# EasyEDA Pro project ESD_System.eprj, schematic Schematic4
Board Name: Ohmeter_Board; Create Date: 2026-07-01; Page Name: P1; Project Name: ESD_System; Schematic Name: Schematic4; Update Date: 2026-07-01; Company: EasyEDA.com; Page Size: A4; Version: V1.0
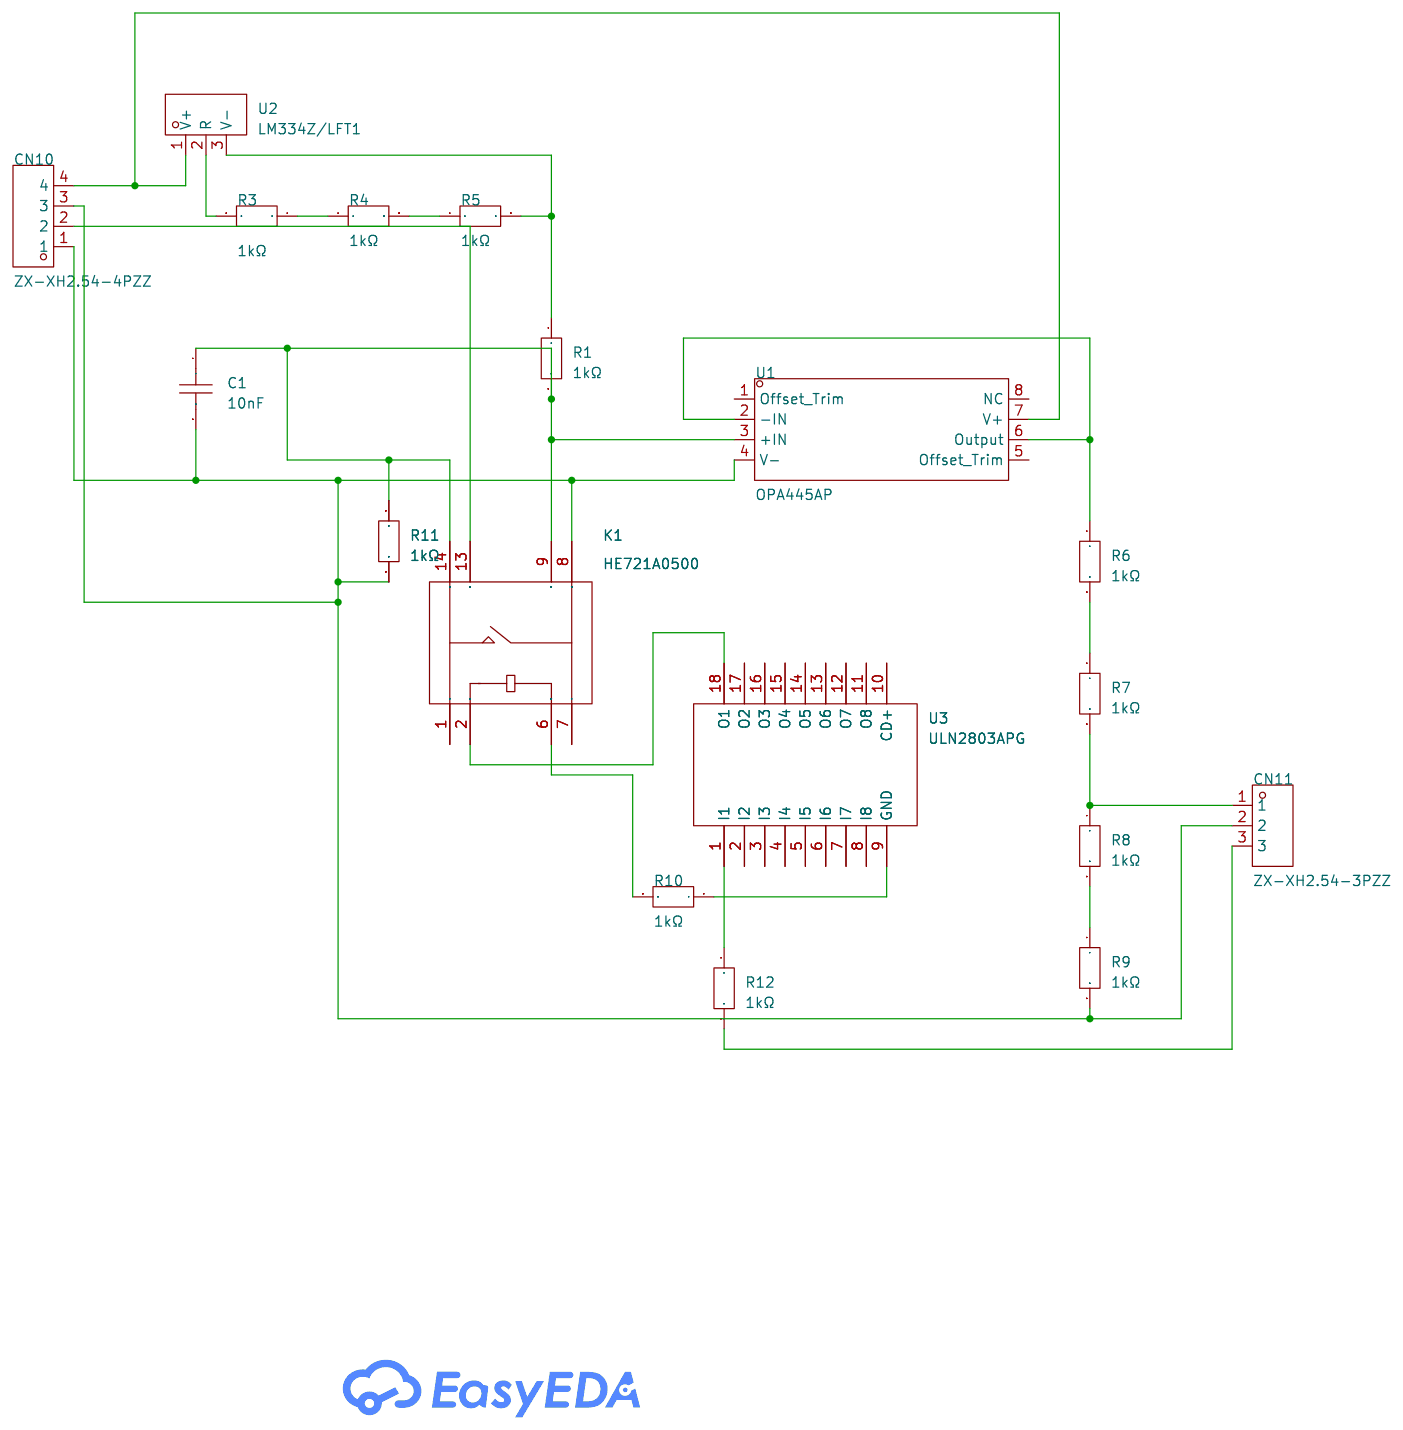
[diagram p3: schematic sheet]

## Parts
C1  10nF  [CAP-TH_L6.5-W4.0-P5.00-D1.0]
CN10  ZX-XH2.54-4PZZ  [CONN-TH_4P-P2.50_4PIN]
CN11  ZX-XH2.54-3PZZ  [CONN-TH_3P-P2.54_2501S-3P]
K1  HE721A0500  [RELAY-TH_HE721A0500]
R1  1kΩ  [RES-TH_BD2.3-L6.5-P10.50-D0.5]
R3  1kΩ  [RES-TH_BD2.3-L6.5-P10.50-D0.5]
R4  1kΩ  [RES-TH_BD2.3-L6.5-P10.50-D0.5]
R5  1kΩ  [RES-TH_BD2.3-L6.5-P10.50-D0.5]
R6  1kΩ  [RES-TH_BD2.3-L6.5-P10.50-D0.5]
R7  1kΩ  [RES-TH_BD2.3-L6.5-P10.50-D0.5]
R8  1kΩ  [RES-TH_BD2.3-L6.5-P10.50-D0.5]
R9  1kΩ  [RES-TH_BD2.3-L6.5-P10.50-D0.5]
R10  1kΩ  [RES-TH_BD2.3-L6.5-P10.50-D0.5]
R11  1kΩ  [RES-TH_BD2.3-L6.5-P10.50-D0.5]
R12  1kΩ  [RES-TH_BD2.3-L6.5-P10.50-D0.5]
U1  OPA445AP  [PDIP-8_L9.6-W6.4-P2.54-LS7.6-BL]
U2  LM334Z/LFT1  [TO-92-3_L4.8-W3.7-P1.27-L]
U3  ULN2803APG  [DIP-18_L23.0-W6.5-P2.54-LS7.6-BL]

## Library data of the parts
C1 = CL112J103J0501: Capacitance:10nF Tolerance:±5% Tolerance:±5% Voltage Rating:630V Dielectric Material:Polyester Operating Temperature:-40℃~+85℃ Operating Temperature:-40℃~+85℃; LCSC Part Name: 10nF ±5% 630V; Supplier Part: C424418; Manufacturer: KYET(科雅); Supplier Footprint: 插件,P=5mm; JLCPCB Part Class: Extended Part; Datasheet: https://item.szlcsc.com/datasheet/CL112J103J0501/417693.html; Supplier: LCSC; Tolerance: ±5%; Voltage Rating: 630V; Dielectric Material: Polyester; Operating Temperature: -40℃~+85℃
CN10 = ZX-XH2.54-4PZZ: Pins Structure:1x4P Pitch:2.5mm Mounting Type:Through Hole Reference Series:XH Number of Pins:4P Number of Rows:1 Number of PINs Per Row:4 Row Spacing:- Current Rating:3A Contact Material:Brass Contact Plating:Tin Operating Temperature:-25℃~+85℃ Operating; LCSC Part Name: 1x4P 间距:2.5mm 直插 系列:XH; Supplier Part: C7429634; Manufacturer: Megastar(兆星); Supplier Footprint: 插件,P=2.5mm; JLCPCB Part Class: Extended Part; Datasheet: https://item.szlcsc.com/datasheet/ZX-XH2.54-4PZZ/8427551.html; Supplier: LCSC; Pins Structure: 1x4P; Pitch: 2.5mm; Mounting Type: Through Hole; Reference Series: XH; Number of Pins: 4P; Number of Rows: 1; Number of PINs Per Row: 4; Current Rating: 3A; Contact Material: Brass; Contact Plating: Tin; Operating Temperature: -25℃~+85℃; Voltage Rating: 250V; Plastic Material: PA66; Flame Retardant Rating: UL94V-0; Color: White; Z-Height of the Board: 7mm; X-Length of Bottom Edge on Board (Spacing Line): 12.5mm; Y-Width of Bottom Edge on Board: 5.9mm
CN11 = ZX-XH2.54-3PZZ: Pins Structure:1x3P Pitch:2.5mm Mounting Type:Through Hole Reference Series:XH Number of Pins:3P Number of Rows:1 Number of PINs Per Row:3 Row Spacing:- Current Rating:3A Contact Material:Brass Contact Plating:Tin Operating Temperature:-25℃~+85℃ Operating; LCSC Part Name: 1x3P 间距:2.5mm 直插 系列:XH; Supplier Part: C7429633; Manufacturer: Megastar(兆星); Supplier Footprint: 插件,P=2.5mm; JLCPCB Part Class: Extended Part; Datasheet: https://item.szlcsc.com/datasheet/ZX-XH2.54-3PZZ/8427550.html; Supplier: LCSC; Pins Structure: 1x3P; Pitch: 2.5mm; Mounting Type: Through Hole; Reference Series: XH; Number of Pins: 3P; Number of Rows: 1; Number of PINs Per Row: 3; Current Rating: 3A; Contact Material: Brass; Contact Plating: Tin; Operating Temperature: -25℃~+85℃; Voltage Rating: 250V; Plastic Material: PA66; Flame Retardant Rating: UL94V-0; Color: White; Z-Height of the Board: 7mm; X-Length of Bottom Edge on Board (Spacing Line): 10mm; Y-Width of Bottom Edge on Board: 5.9mm
K1 = HE721A0500: Coil Voltage:5V Contact Form:1 Form A: 1A (SPST-NO) Number of Pins:8 Switching Voltage(Max):200V@DC Coil Type:Non-Polarized - Single Coil Switching Power(Max):10W Load Current(Max):1.2A Coil Resistance:500Ω Switching Current(Max):500mA Operate Time:1ms Re; LCSC Part Name: 5V继电器 单刀单掷-常开; Supplier Part: C151704; Manufacturer: Littelfuse(美国力特); Supplier Footprint: DIP,19.1x7.2mm; JLCPCB Part Class: Extended Part; Datasheet: https://item.szlcsc.com/datasheet/HE721A0500/163044.html; Supplier: LCSC; Coil Voltage: 5V; Contact Form: 1 Form A: 1A (SPST-NO); Number of Pins: 8; Switching Voltage(Max): 200V@DC; Coil Type: Non-Polarized - Single Coil; Switching Power(Max): 10W; Load Current(Max): 1.2A; Coil Resistance: 500Ω; Switching Current(Max): 500mA; Operate Time: 1ms; Release Time: 1ms; Contact Resistance: 150mΩ; Operating Temperature: -40℃~+85℃
R1 R3-R12 = MF1/4W-1KΩ±1%T52: Type:Metal Film Resistors Resistance: Tolerance:±1% Tolerance:±1% Power(Watts):250mW Temperature Coefficient:±200ppm/℃ Temperature Coefficient:±200ppm/℃; LCSC Part Name: 金属膜电阻 1kΩ ±1% 250mW; Supplier Part: C713997; Manufacturer: 华星机电; Supplier Footprint: 插件,D2.3xL6.5mm; JLCPCB Part Class: Extended Part; Datasheet: https://atta.szlcsc.com/upload/public/pdf/source/20200731/C713882_AE8EB1102749D7E4FB4FB13DC898C429.pdf; Supplier: LCSC; Type: Metal Film Resistors; Tolerance: ±1%; Power(Watts): 250mW; Temperature Coefficient: ±200ppm/℃
U1 = OPA445AP: Number of Channels:1 Maximum Power Supply Range (Vdd-Vss):90V Rail to Rail:- Gain Bandwidth Product:2MHz Vos - Input Offset Voltage:3mV Input Offset Voltage Drift(Vos TC):100uV/℃ Slew Rate:15V/us Ib - Input Bias Current:100pA Input Offset Current(Ios):40p; LCSC Part Name: 高压场效应管输入运算放大器; Supplier Part: C34093; Manufacturer: TI(德州仪器); Supplier Footprint: DIP-8; JLCPCB Part Class: Extended Part; Datasheet: https://www.ti.com/cn/lit/gpn/opa445; Supplier: LCSC; Number of Channels: 1; Maximum Power Supply Range (Vdd-Vss): 90V; Gain Bandwidth Product: 2MHz; Vos - Input Offset Voltage: 3mV; Input Offset Voltage Drift(Vos TC): 100uV/℃; Slew Rate: 15V/us; Ib - Input Bias Current: 100pA; Input Offset Current(Ios): 40pA; Input Voltage Noise Density: 15nV/√Hz@1kHz; Common Mode Rejection Ratio(CMRR): 80dB; Quiescent Current: 4.7mA; Output Current: 15mA; Operating Temperature: -55℃~+125℃; Dual Supply: -10V~10V；-45V~45V
U2 = LM334Z/LFT1: Type:Current Source Voltage - Supply:1V~40V Voltage - Supply:1V~40V Tolerance:±6% Tolerance:±6% Operating Temperature:0℃~+70℃ Operating Temperature:0℃~+70℃; Supplier Part: C2866735; Manufacturer: TI(德州仪器); Supplier Footprint: TO-92-3; JLCPCB Part Class: Extended Part; Datasheet: https://www.ti.com/cn/lit/gpn/lm334; Supplier: LCSC; Type: Current Source; Voltage - Supply: 1V~40V; Tolerance: ±6%; Operating Temperature: 0℃~+70℃
U3 = ULN2803APG: number of channels:8; LCSC Part Name: 停产 双极数字集成电路，8通道达林顿灌电流驱动器，内置钳位二极管，输入与多种逻辑兼容; Supplier Part: C5252; Manufacturer: TOSHIBA(东芝); Supplier Footprint: DIP-18; JLCPCB Part Class: Extended Part; Datasheet: https://item.szlcsc.com/datasheet/ULN2803APG/5673.html; Supplier: LCSC; number of channels: 8

## Nets
$1N601: R3.1 R4.1
$1N605: R4.2 R5.1
$1N610: R1.1 R5.2 U2.3(V-)
$1N617: R3.2 U2.2(R)
$1N688: CN10.4 U1.7(V+) U2.1(V+)
$1N937: R6.1 U1.2(-IN) U1.6(Output)
$1N1097: R6.2 R7.1
$1N1102: CN11.1 R7.2 R8.1
$1N2021: K1.2 U3.18(O1)
$1N2069: K1.6 R10.2
$1N2161: C1.1 K1.9 K1.14 R1.2 R11.1 U1.3(+IN)
$1N2240: CN10.2 K1.13
$1N2316: R10.1 U3.9(GND)
$1N2341: R12.1 U3.1(I1)
$1N2344: R8.2 R9.1
$1N2424: CN11.3 R12.2
$1N2446: C1.2 CN10.1 CN10.3 CN11.2 K1.8 R9.2 R11.2 U1.4(V-)

Not connected (* = marked no-connect by the designer): K1 1 7; U1 1(Offset Trim) 5(Offset Trim) 8(NC); U3 2(I2) 3(I3) 4(I4) 5(I5) 6(I6) 7(I7) 8(I8) 10(CD+) 11(O8) 12(O7) 13(O6) 14(O5) 15(O4) 16(O3) 17(O2)
